# Altium schematic sheet 平衡小车主板原理图.SchDoc
size A3
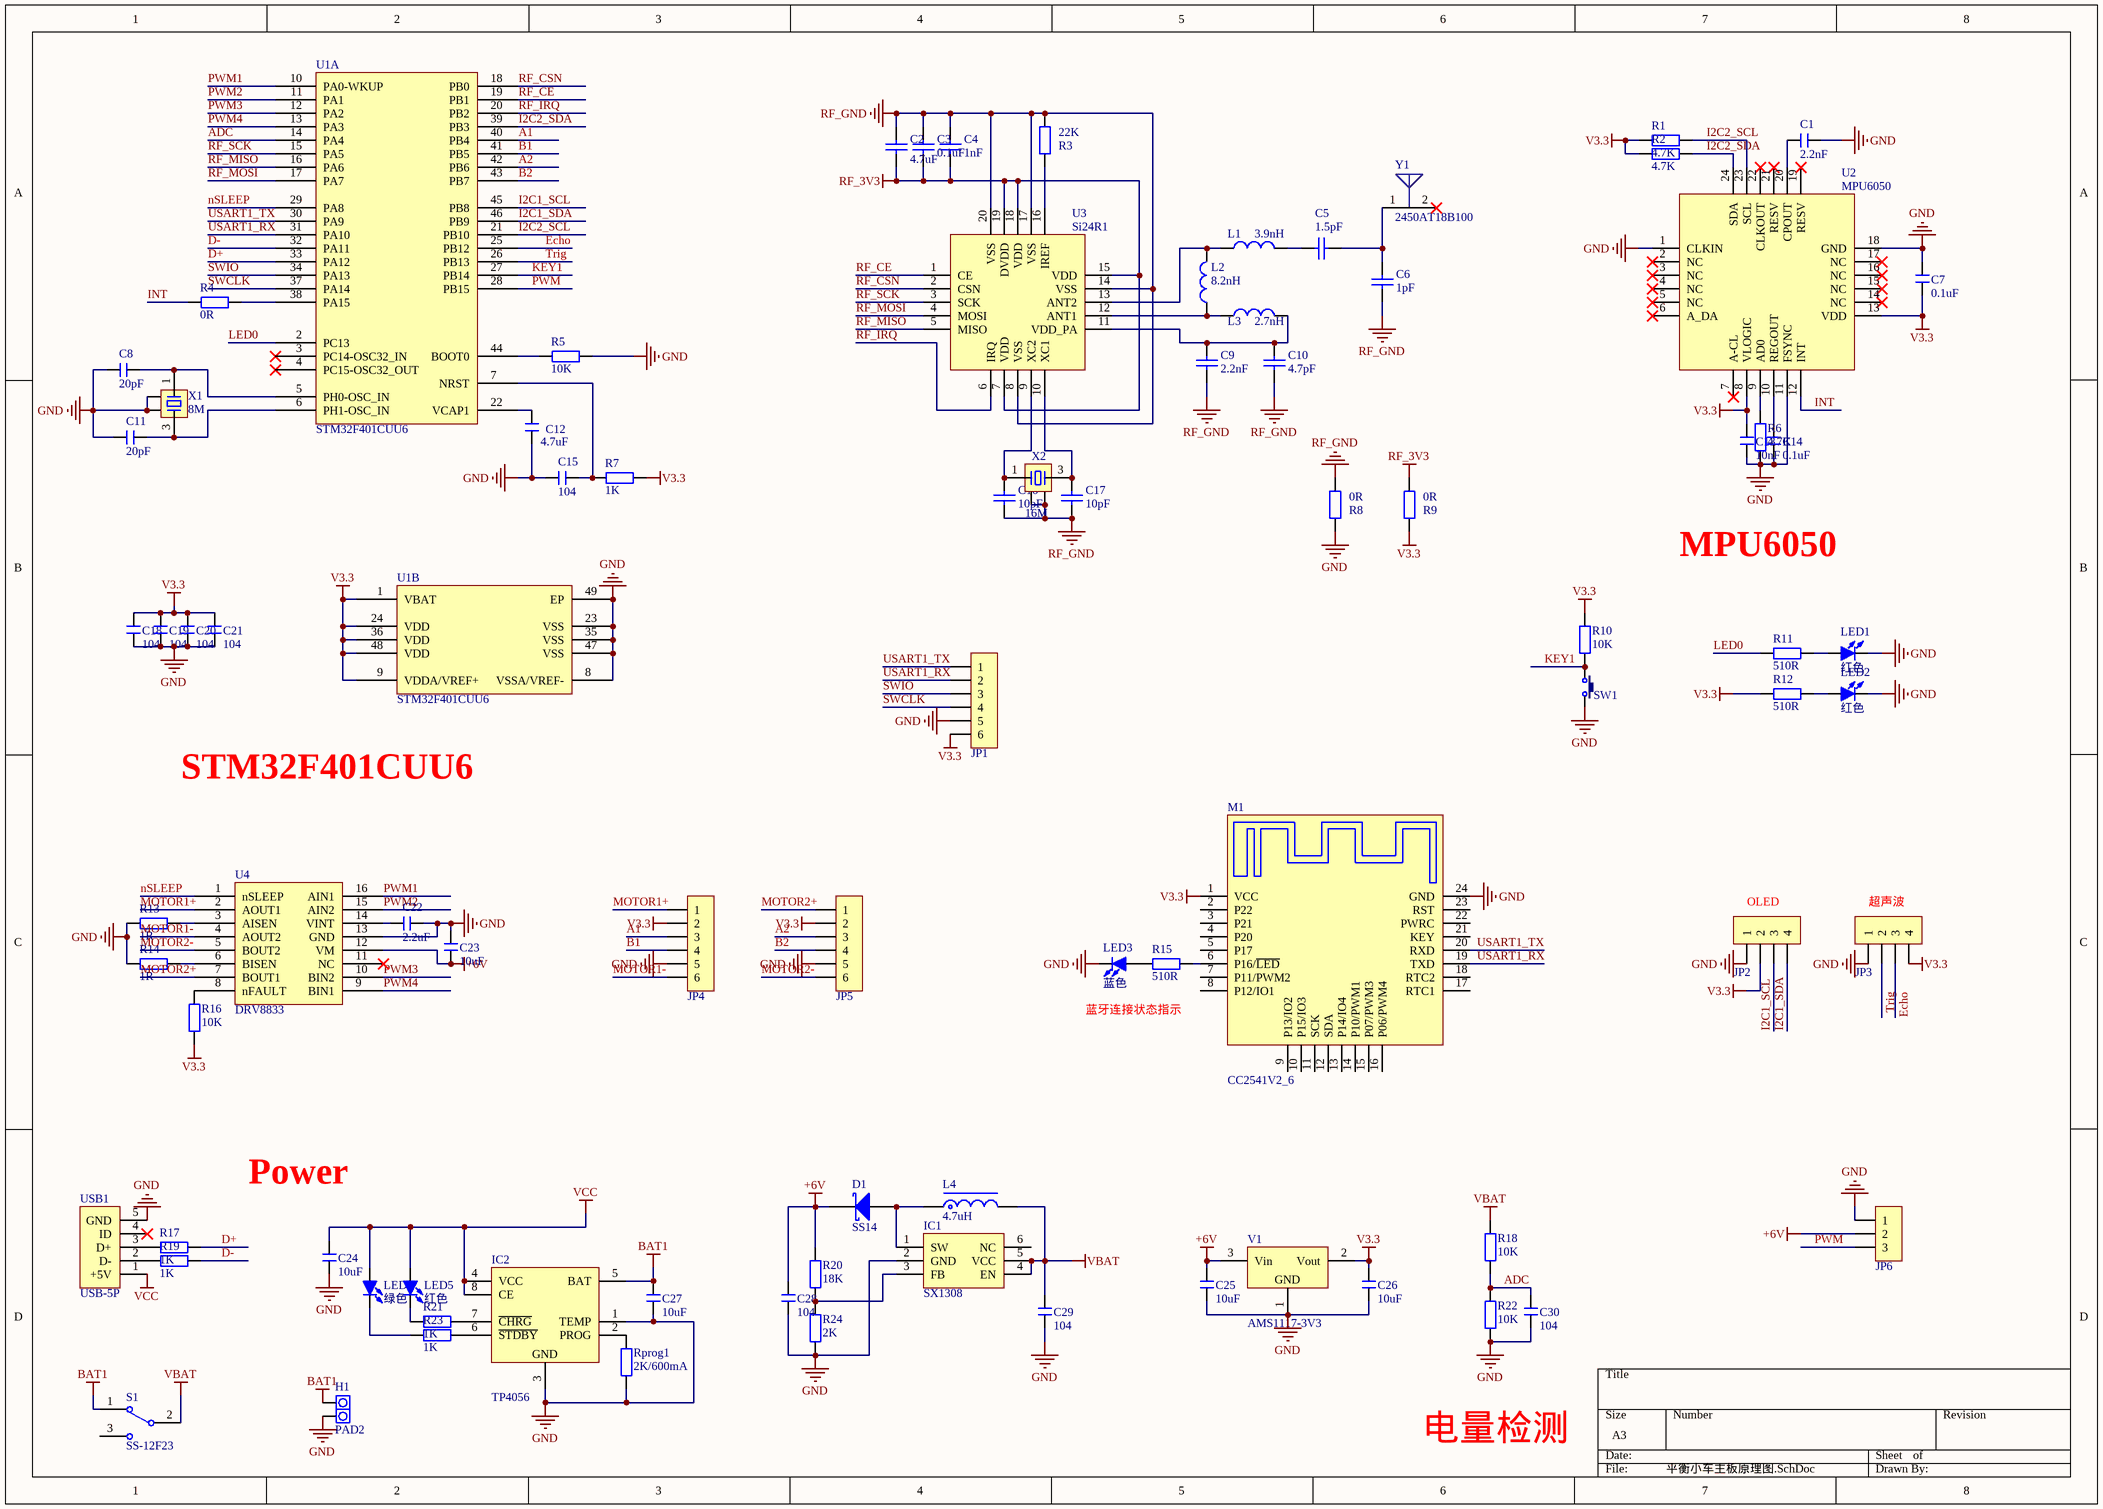
[diagram p0: 平衡小车主板原理图.SchDoc]

## Parts
C1  2.2nF  [C 0603_L]
C2  value 4.7uF  [C 0603_L]  (hidden comment: C_0603)
C3  value 0.1uF  [C 0603_L]  (hidden comment: C_0603)
C4  value 1nF  [C 0603_L]  (hidden comment: C_0603)
C5  value 1.5pF  [C 0603_L]  (hidden comment: C_0603)
C6  value 1pF  [C 0603_L]  (hidden comment: C_0603)
C7  0.1uF  [C 0603_L]
C8  20pF  [R 0603_M]
C9  value 2.2nF  [C 0603_L]  (hidden comment: C_0603)
C10  value 4.7pF  [C 0603_L]  (hidden comment: C_0603)
C11  20pF  [R 0603_M]
C12  4.7uF  [C 0603_L]
C13  10nF  [C 0603_L]
C14  0.1uF  [C 0603_L]
C15  104  [C 0603_L]
C16  value 10pF  [C 0603_L]  (hidden comment: C_0603)
C17  value 10pF  [C 0603_L]  (hidden comment: C_0603)
C18  104  [C 0603_L]
C19  104  [C 0603_L]
C20  104  [C 0603_L]
C21  104  [C 0603_L]
C22  2.2uF  [C 0603_L]
C23  10uF  [C 0603_L]
C24  10uF  [C 0603_L]
C25  10uF  [C 0603_L]
C26  10uF  [C 0603_L]
C27  10uF  [C 0603_L]
C28  104  [C 0603_L]
C29  104  [C 0603_L]
C30  104  [C 0603_L]
D1  SS14  [SMA]
H1  PAD2  [PAD2-2.54]
IC1  SX1308  [SOT23-6N]
IC2  TP4056  [SOP8_N]
JP1  HDR-1X6  [SH1.0-6P]  (value not drawn)
JP2  HDR-1X4  [HDR2.54-M-LI-4P]  (value not drawn)
JP3  HDR-1X4  [HDR2.54-M-LI-4P]  (value not drawn)
JP4  HDR-1X6  [SH1.0-6P]  (value not drawn)
JP5  HDR-1X6  [SH1.0-6P]  (value not drawn)
JP6  HDR-1X3  [HDR2.54-LI-3P]  (value not drawn)
L1  value 3.9nH  [L 0603]  (hidden comment: Inductor)
L2  value 8.2nH  [L 0603]  (hidden comment: Inductor)
L3  value 2.7nH  [L 0603]  (hidden comment: Inductor)
L4  4.7uH  [NR4020]
LED1  红色  [LED 0603R]
LED2  红色  [LED 0603R]
LED3  蓝色  [LED 0603B]
LED4  绿色  [LED 0603G]
LED5  红色  [LED 0603R]
M1  CC2541V2_6  [CC2541V2_6]
R1  4.7K  [R 0603_L]
R2  4.7K  [R 0603_L]
R3  value 22K  [R 0603_L]  (hidden comment: R_0603)
R4  0R  [R 0603_L]
R5  10K  [R 0603_L]
R6  4.7K  [R 0603_L]
R7  1K  [R 0603_L]
R8  value 0R  [R 0603_L]  (hidden comment: R_0603)
R9  value 0R  [R 0603_L]  (hidden comment: R_0603)
R10  10K  [R 0603_L]
R11  510R  [R 0603_L]
R12  510R  [R 0603_L]
R13  1R  [R 0603_L]
R14  1R  [R 0603_L]
R15  510R  [R 0603_L]
R16  10K  [R 0603_L]
R17  1K  [R 0603_L]
R18  10K  [R 0603_L]
R19  1K  [R 0603_L]
R20  18K  [R 0603_L]
R21  1K  [R 0603_L]
R22  10K  [R 0603_L]
R23  1K  [R 0603_L]
R24  2K  [R 0603_L]
Rprog1  2K/600mA  [R 0603_M]
S1  SS-12F23  [SWITCH_PWR]
SW1  3x6x5  [TSW SMD-3*6*2.5]  (value not drawn)
U1  STM32F401CUU6  [QFN48 7X7_M]  (parts A,B of 2)
U2  MPU6050  [QFN24 4x4_M]
U3  Si24R1  [QFN20 4x4_M]
U4  DRV8833  [TSSOP-16]
USB1  USB-5P  [USB-MICRO_D]
V1  AMS1117-3V3  [SOT223_L]
X1  8M  [OSC 3225-4P]
X2  16M  [OSC 3225-4P]
Y1  2450AT18B100  [1206]

## Nets
+6V: C23.1 C25.2 C28.2 D1.2(K) JP6.2 R20.2 U4.12(VM) V1.3(Vin)
BAT1: C27.2 H1.1 IC2.5(BAT) S1.1
GND: C1.1 C7.2 C8.2 C11.2 C12.2 C13.1 C14.1 C15.1 C18.1 C19.1 C20.1 C21.1 C22.1 C23.2 C24.1 C25.1 C26.1 C27.1 C28.1 C29.1 C30.1 H1.2 IC1.2(GND) IC2.1(TEMP) IC2.3(GND) JP1.5 JP2.1 JP3.1 JP4.5 JP5.5 JP6.1 LED1.2(K) LED2.2(K) LED3.2(K) M1.24(GND) R5.1 R6.2 R8.1 R13.2 R14.2 R22.1 R24.1 Rprog1.1 SW1.2 U1.8(VSSA/VREF-) U1.23(VSS) U1.35(VSS) U1.47(VSS) U1.49(EP) U2.1(CLKIN) U2.11(FSYNC) U2.18(GND) U4.13(GND) USB1.5(GND) V1.1(GND) X1.2 X1.4
RF_3V3: C2.1 C3.1 C4.1 R9.2 U3.7(VDD) U3.15(VDD) U3.18(VDD) U3.19(DVDD)
RF_GND: C2.2 C3.2 C4.2 C6.1 C9.1 C10.1 C16.1 C17.1 R3.2 R8.2 U3.8(VSS) U3.14(VSS) U3.17(VSS) U3.20(VSS) X2.2 X2.4
V3.3: C7.1 C13.2 C18.2 C19.2 C20.2 C21.2 C26.2 JP1.6 JP2.2 JP3.4 JP4.2 JP5.2 M1.1(VCC) R1.2 R2.2 R7.2 R9.1 R10.1 R12.2 R16.1 U1.1(VBAT) U1.9(VDDA/VREF+) U1.24(VDD) U1.36(VDD) U1.48(VDD) U2.8(VLOGIC) U2.13(VDD) V1.2(Vout)
VBAT: C29.2 IC1.4(EN) IC1.5(VCC) L4.2 R18.2 S1.2
VCC: C24.2 IC2.4(VCC) IC2.8(CE) LED4.1(A) LED5.1(A) USB1.1(+5V)
A1: JP4.3 U1.40(PB4)
A2: JP5.3 U1.42(PB6)
ADC: C30.2 R18.1 R22.2 U1.14(PA4)
B1: JP4.4 U1.41(PB5)
B2: JP5.4 U1.43(PB7)
D+: R17.2 U1.33(PA12)
D-: R19.2 U1.32(PA11)
Echo: JP3.3 U1.25(PB12)
I2C1_SCL: JP2.3 U1.45(PB8)
I2C1_SDA: JP2.4 U1.46(PB9)
I2C2_SCL: R1.1 U1.21(PB10) U2.23(SCL)
I2C2_SDA: R2.1 U1.39(PB3) U2.24(SDA)
INT: R4.1 U2.12(INT)
KEY1: R10.2 SW1.1 U1.27(PB14)
LED0: R11.2 U1.2(PC13)
MOTOR1+: JP4.1 U4.2(AOUT1)
MOTOR1-: JP4.6 U4.4(AOUT2)
MOTOR2+: JP5.1 U4.7(BOUT1)
MOTOR2-: JP5.6 U4.5(BOUT2)
nSLEEP: U1.29(PA8) U4.1(nSLEEP)
PWM: JP6.3 U1.28(PB15)
PWM1: U1.10(PA0-WKUP) U4.16(AIN1)
PWM2: U1.11(PA1) U4.15(AIN2)
PWM3: U1.12(PA2) U4.10(BIN2)
PWM4: U1.13(PA3) U4.9(BIN1)
RF_CE: U1.19(PB1) U3.1(CE)
RF_CSN: U1.18(PB0) U3.2(CSN)
RF_IRQ: U1.20(PB2) U3.6(IRQ)
RF_MISO: U1.16(PA6) U3.5(MISO)
RF_MOSI: U1.17(PA7) U3.4(MOSI)
RF_SCK: U1.15(PA5) U3.3(SCK)
SWCLK: JP1.4 U1.37(PA14)
SWIO: JP1.3 U1.34(PA13)
Trig: JP3.2 U1.26(PB13)
USART1_RX: JP1.2 M1.19(TXD) U1.31(PA10)
USART1_TX: JP1.1 M1.20(RXD) U1.30(PA9)
NetC1_2: C1.2 U2.20(CPOUT)
NetC5_1: C5.1 L1.2
NetC5_2: C5.2 C6.2 Y1.1(FP)
NetC8_1: C8.1 U1.5(PH0-OSC_IN) X1.1
NetC9_2: C9.2 C10.2 L3.2 U3.11(VDD_PA)
NetC11_1: C11.1 U1.6(PH1-OSC_IN) X1.3
NetC12_1: C12.1 U1.22(VCAP1)
NetC14_2: C14.2 U2.10(REGOUT)
NetC15_2: C15.2 R7.1 U1.7(NRST)
NetC16_2: C16.2 U3.9(XC2) X2.1
NetC17_2: C17.2 U3.10(XC1) X2.3
NetC22_2: C22.2 U4.14(VINT)
NetD1_1: D1.1(A) IC1.1(SW) L4.1
NetIC1_3: IC1.3(FB) R20.1 R24.2
NetIC2_2: IC2.2(PROG) Rprog1.2
NetIC2_6: IC2.6(~{STDBY}) R23.2
NetIC2_7: IC2.7(~{CHRG}) R21.1
NetL1_1: L1.1 L2.2 U3.13(ANT2)
NetL2_1: L2.1 L3.1 U3.12(ANT1)
NetLED1_1: LED1.1(A) R11.1
NetLED2_1: LED2.1(A) R12.1
NetLED3_1: LED3.1(A) R15.2
NetLED4_2: LED4.2(K) R23.1
NetLED5_2: LED5.2(K) R21.2
NetM1_6: M1.6(P16/~{LED}) R15.1
NetR3_1: R3.1 U3.16(IREF)
NetR4_2: R4.2 U1.38(PA15)
NetR5_2: R5.2 U1.44(BOOT0)
NetR6_1: R6.1 U2.9(AD0)
NetR13_1: R13.1 U4.3(AISEN)
NetR14_1: R14.1 U4.6(BISEN)
NetR16_2: R16.2 U4.8(nFAULT)
NetR17_1: R17.1 USB1.3(D+)
NetR19_1: R19.1 USB1.2(D-)

Not connected (* = marked no-connect by the designer): IC1 6(NC); M1 2(P22) 3(P21) 4(P20) 5(P17) 7(P11/PWM2) 8(P12/IO1) 9(P13/IO2) 10(P15/IO3) 11(SCK) 12(SDA) 13(P14/IO4) 14(P10/PWM1) 15(P07/PWM3) 16(P06/PWM4) 17(RTC1) 18(RTC2) 21(KEY) 22(PWRC) 23(RST); S1 3; U1 3(PC14-OSC32_IN)* 4(PC15-OSC32_OUT)*; U2 2(NC)* 3(NC)* 4(NC)* 5(NC)* 6(A_DA)* 7(A-CL)* 14(NC)* 15(NC)* 16(NC)* 17(NC)* 19(RESV)* 21(RESV)* 22(CLKOUT)*; U4 11(NC)*; USB1 4(ID)*; Y1 2(NC)*

## Notes on the sheet
- MPU6050
- STM32F401CUU6
- (near JP2) OLED
- (near JP3) 超声波
- 蓝牙连接状态指示
- Power
- 电量检测

## Library data of the parts
C1 C7 C8 C11-C15 C18-C30 = C: 贴片电容; BOM名称: 无极性贴片电容; 淘宝ID: 封装库来自淘宝 ID：黄晶宝石; 联系售后: https://shop463601444.taobao.com
D1 = SS14: 肖特基二极管; 属性: 40V/1A; BOM名称: 肖特基二极管; 封装库来自淘宝 ID：黄晶宝石: https://shop463601444.taobao.com
H1 = PAD2: 引线焊盘; 版权归属: 封装库来自淘宝 ID：黄晶宝石; BOM名称: 引线焊盘; 学习资源: https://shop463601444.taobao.com
IC1 = SX1308: 可调升压芯片; 版权归属: 封装库来自淘宝 ID：黄晶宝石; BOM名称: 可调升压芯片; 学习资源: www.ooocke.com
IC2 = TP4056: 锂电池充电管理; 淘宝ID: 封装库来自淘宝 ID：黄晶宝石; BOM名称: 锂电池充电管理; 学习资源: https://shop463601444.taobao.com
JP1 JP4 JP5 = Header 6: 6P接插件; 版权归属: 封装库来自淘宝 ID：黄晶宝石; BOM名称: 6P接插件; 学习资源: https://shop463601444.taobao.com
JP2 JP3 = Header 4: 4P接插件; 版权归属: 封装库来自淘宝 ID：黄晶宝石; BOM名称: 4P接插件; 学习资源: https://shop463601444.taobao.com
JP6 = Header 3: 3P接插件; 版权归属: 封装库来自淘宝 ID：黄晶宝石; BOM名称: 3P接插件; 学习资源: https://shop463601444.taobao.com
L1-L3 = Inductor_1: 电感; Code_IEC: 1005; Published: 8-Jun-2000; LatestRevisionDate: 17-Jul-2002; LatestRevisionNote: Re-released for DXP Platform.; PackageReference: 0402-A; Publisher: Altium Limited; Code_JEITA: 0402
L4 = L-NR: NR磁胶电感; 版权归属: 来自淘宝 ID：黄晶宝石; BOM名称: NR磁胶电感; 联系售后: https://shop463601444.taobao.com
LED1-LED5 = LED-SMD: 贴片LED; 版权归属: 封装库来自淘宝 ID：黄晶宝石; BOM名称: 贴片LED; 学习资源: https://shop463601444.taobao.com
M1 = CC2541V2_6: 蓝牙4.0透传模块; 版权归属: 封装库来自淘宝 ID：黄晶宝石; BOM名称: 蓝牙4.0透传模块; 学习资源: https://shop463601444.taobao.com
R1 R2 R4-R7 R10-R24 Rprog1 = R: 贴片电阻; 版权归属: 来自淘宝 ID：黄晶宝石; BOM名称: 贴片电阻; 联系售后: https://shop463601444.taobao.com
S1 = SSW-1P: 1路波动开关; BOM名称: 波动开关; 版权归属: 封装库来自淘宝 ID：黄晶宝石; 学习资源: www.ooocke.com
SW1 = TSW 3x6: 3x6轻触开关; 版权归属: 封装库来自淘宝 ID：黄晶宝石; BOM名称: 3x6轻触开关; 学习资源: www.ooocke.com
U3 = nRF24L01
U4 = DRV8833: DRV8833电机驱动芯片2.7v-10.8v
USB1 = USB-5P: 微型USB母座; BOM名称: 微型USB母座; 学习资源: https://shop463601444.taobao.com
V1 = AMS1117: 三端稳压芯片; BOM名称: 稳压芯片; 淘宝ID: 封装库来自淘宝 ID：黄晶宝石; 欢迎光临淘宝店铺: https://shop463601444.taobao.com
X1 X2 = XTAL-4P: 4脚无源晶振; 版权归属: 源创客; BOM名称: 4脚无源晶振; 学习资源: www.ooocke.com
Y1 = CHIP_ANTENNA
C2-C6 C9 C10 C16 C17 = C_0603: Published: 8-Jun-2000; LatestRevisionDate: 17-Jul-2002; LatestRevisionNote: Re-released for DXP Platform.; PackageReference: RAD-0.3; Publisher: Altium Limited; PackageDescription: Radial Cap, Thru-Hole; 2 Leads; 0.3 in Pin Spacing
R3 R8 R9 = R_0603: Published: 8-Jun-2000; LatestRevisionDate: 17-Jul-2002; LatestRevisionNote: Re-released for DXP Platform.; PackageReference: AXIAL-0.4; Publisher: Altium Limited; PackageDescription: Axial Device, Thru-Hole; 2 Leads; 0.4 in Pin Spacing